# Altium schematic sheet 最小系统405RGT6.SchDoc
size A3
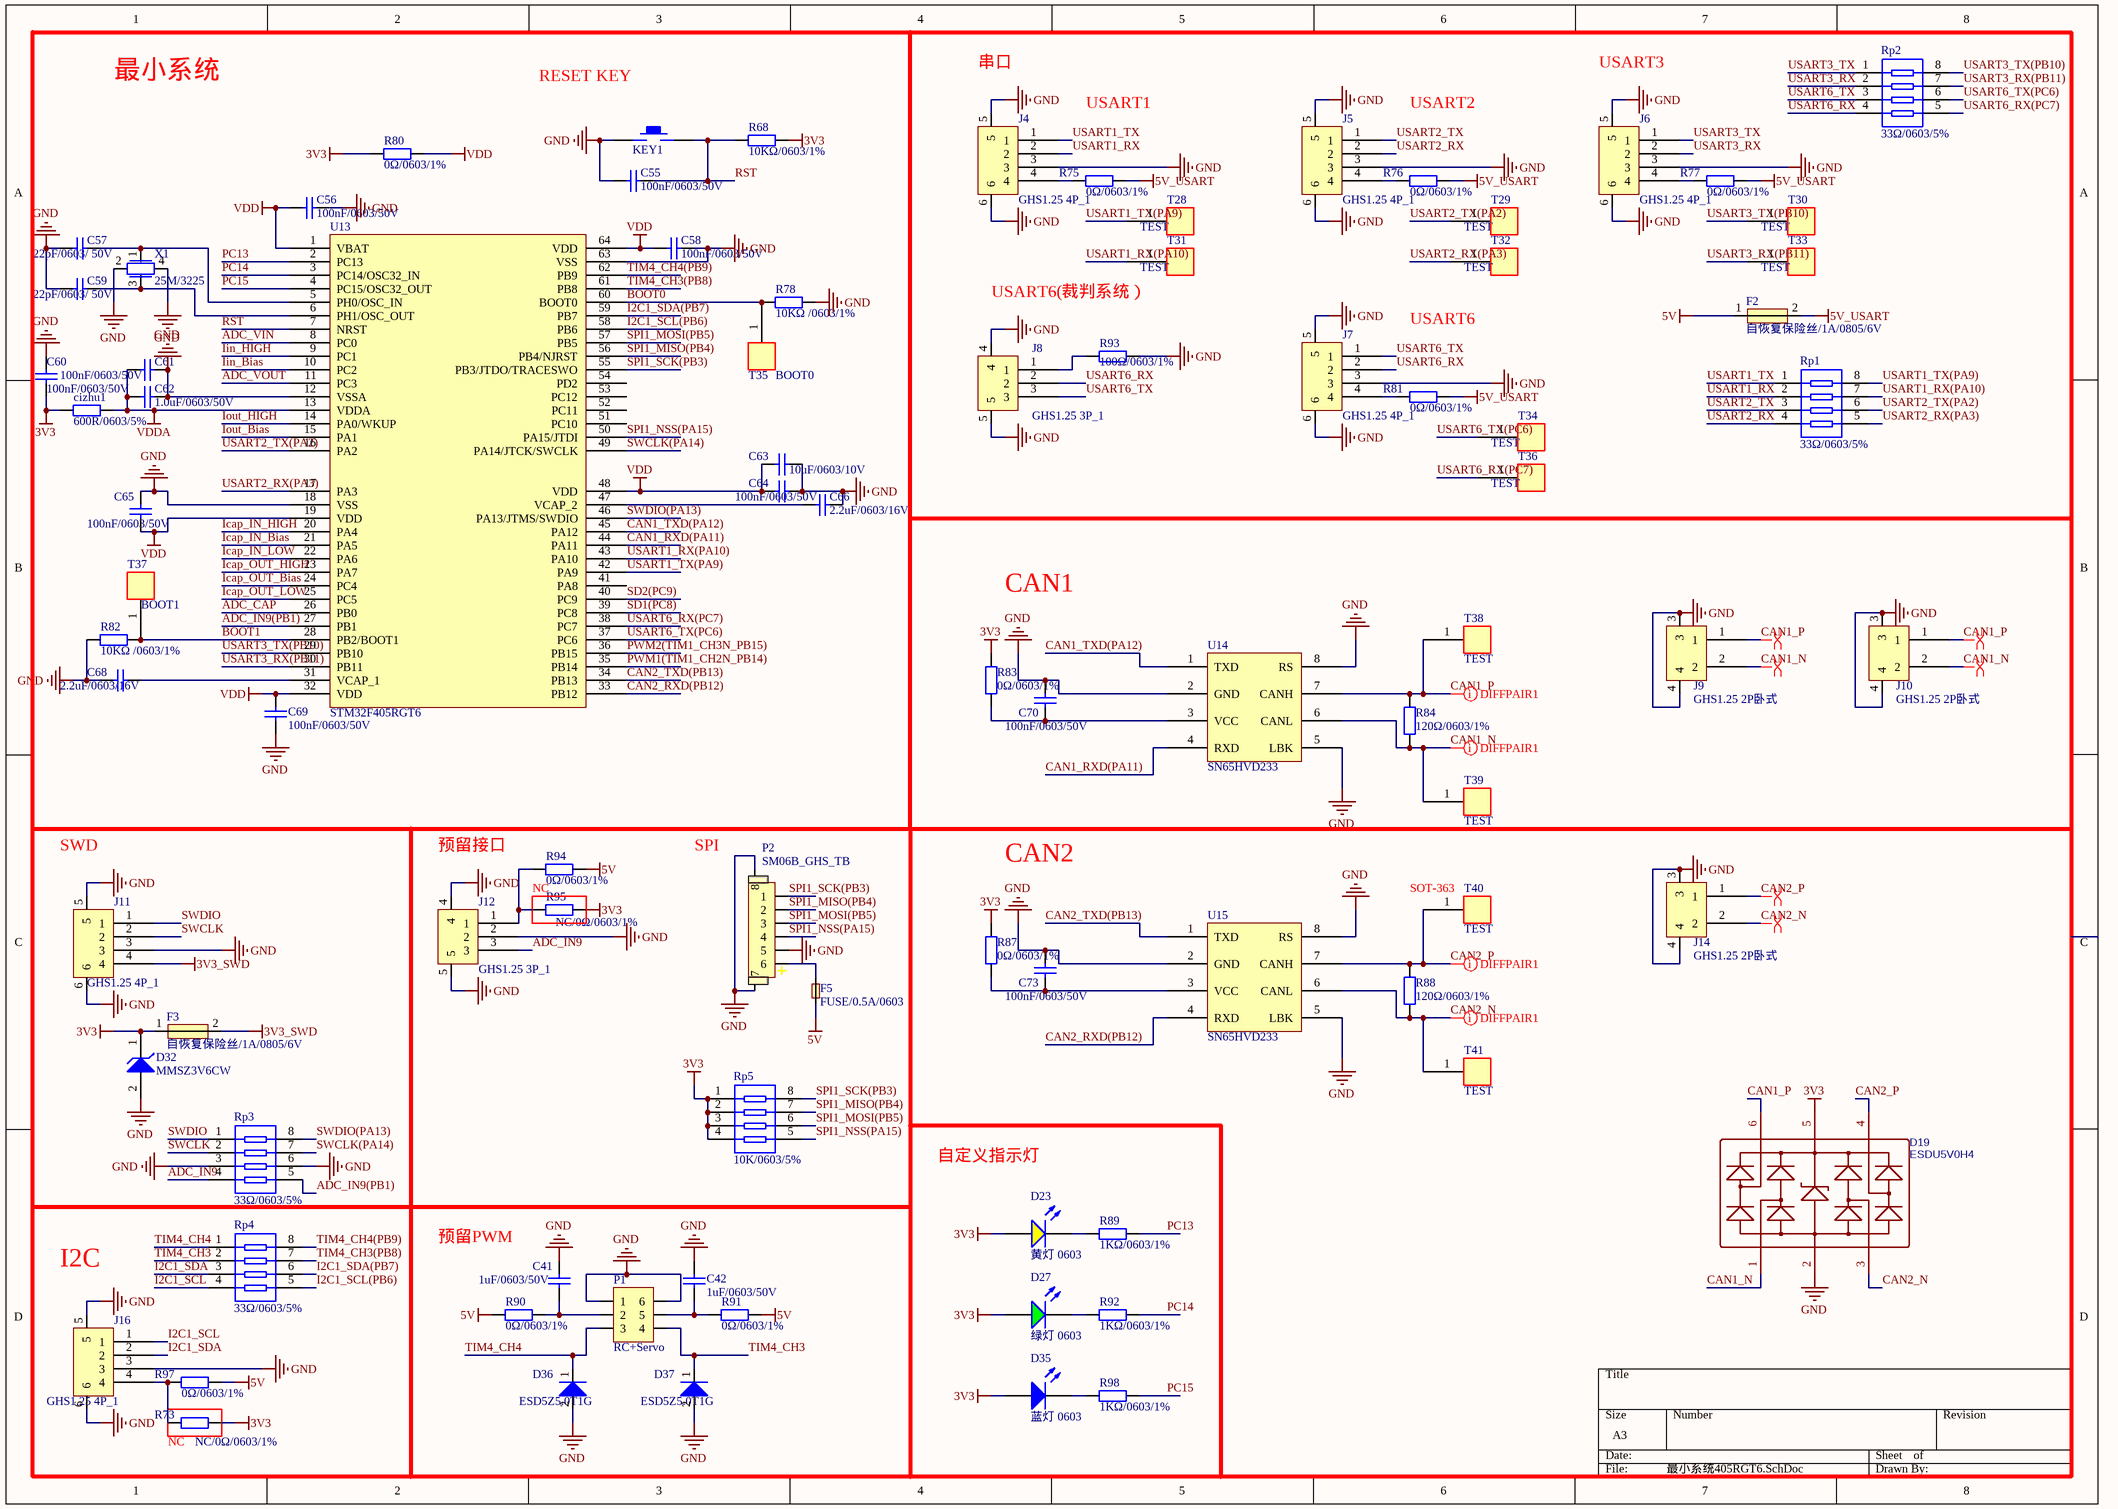
[diagram p0: 最小系统405RGT6.SchDoc]

## Parts
C41  1uF/0603/50V  [0603_C]
C42  1uF/0603/50V  [0603_C]
C55  100nF/0603/50V  [0603_C]
C56  100nF/0603/50V  [0603_C]
C57  22pF/0603/ 50V  [0603_C]
C58  100nF/0603/50V  [0603_C]
C59  22pF/0603/ 50V  [0603_C]
C60  100nF/0603/50V  [0603_C]
C61  100nF/0603/50V  [0603_C]
C62  1.0uF/0603/50V  [0603_C]
C63  10uF/0603/10V  [0603_C]
C64  100nF/0603/50V  [0603_C]
C65  100nF/0603/50V  [0603_C]
C66  2.2uF/0603/16V  [0603_C]
C68  2.2uF/0603/16V  [0603_C]
C69  100nF/0603/50V  [0603_C]
C70  100nF/0603/50V  [0603_C]
C73  100nF/0603/50V  [0603_C]
cizhu1  600R/0603/5%  [0603_R]
D19  ESDU5V0H4  [SOT-23-6_L2.9-W1.6-P0.95-LS2.8-BR]
D23  黄灯 0603  [0603_LED_S1]
D27  绿灯 0603  [0603_LED_S1]
D32  MMSZ3V6CW  [SOD-123]
D35  蓝灯 0603  [0603_LED_S1]
D36  ESD5Z5.0T1G  [SOD-523]
D37  ESD5Z5.0T1G  [SOD-523]
F2  自恢复保险丝/1A/0805/6V  [0805_R]
F3  自恢复保险丝/1A/0805/6V  [0805_R]
F5  FUSE/0.5A/0603  [0.5A/0603]
J4  GHS1.25 4P_1  [SM04B-GHS卧式]
J5  GHS1.25 4P_1  [SM04B-GHS卧式]
J6  GHS1.25 4P_1  [SM04B-GHS卧式]
J7  GHS1.25 4P_1  [SM04B-GHS卧式]
J8  GHS1.25 3P_1  [SM03B_GHS卧式]
J9  GHS1.25 2P卧式  [SM02B-GHS卧式]
J10  GHS1.25 2P卧式  [SM02B-GHS卧式]
J11  GHS1.25 4P_1  [SM04B-GHS卧式]
J12  GHS1.25 3P_1  [SM03B_GHS卧式]
J14  GHS1.25 2P卧式  [SM02B-GHS卧式]
J16  GHS1.25 4P_1  [SM04B-GHS卧式]
KEY1  KEY  [SW-SMD1]  (value not drawn)
P1  RC+Servo  [RC+Servo]
P2  SM06B_GHS_TB  [SM06B-GHS-TB]
R68  10KΩ/0603/1%  [0603_R]
R73  NC/0Ω/0603/1%  [0603_R]
R75  0Ω/0603/1%  [0603_R]
R76  0Ω/0603/1%  [0603_R]
R77  0Ω/0603/1%  [0603_R]
R78  10KΩ /0603/1%  [0603_R]
R80  0Ω/0603/1%  [0603_R]
R81  0Ω/0603/1%  [0603_R]
R82  10KΩ /0603/1%  [0603_R]
R83  0Ω/0603/1%  [0603_R]
R84  120Ω/0603/1%  [0603_R]
R87  0Ω/0603/1%  [0603_R]
R88  120Ω/0603/1%  [0603_R]
R89  1KΩ/0603/1%  [0603_R]
R90  0Ω/0603/1%  [0603_R]
R91  0Ω/0603/1%  [0603_R]
R92  1KΩ/0603/1%  [0603_R]
R93  100Ω/0603/1%  [0603_R]
R94  0Ω/0603/1%  [0603_R]
R95  NC/0Ω/0603/1%  [0603_R]
R97  0Ω/0603/1%  [0603_R]
R98  1KΩ/0603/1%  [0603_R]
Rp1  33Ω/0603/5%  [0603_Rx4]
Rp2  33Ω/0603/5%  [0603_Rx4]
Rp3  33Ω/0603/5%  [0603_Rx4]
Rp4  33Ω/0603/5%  [0603_Rx4]
Rp5  10K/0603/5%  [0603_Rx4]
T28  TEST  [测试点]
T29  TEST  [测试点]
T30  TEST  [测试点]
T31  TEST  [测试点]
T32  TEST  [测试点]
T33  TEST  [测试点]
T34  TEST  [测试点]
T35  BOOT0  [测试点]
T36  TEST  [测试点]
T37  BOOT1  [测试点]
T38  TEST  [测试点]
T39  TEST  [测试点]
T40  TEST  [测试点]
T41  TEST  [测试点]
U13  STM32F405RGT6  [LQFP64_M]
U14  SN65HVD233  [SOIC-8_150mil]
U15  SN65HVD233  [SOIC-8_150mil]
X1  25M/3225  [SMD-3225_4P]

## Nets
3V3: C60.2 cizhu1.1 D19.5(VCC) D23.A D27.A D32.1(K) D35.A F3.1 R68.2 R73.2 R80.1 R83.2 R87.2 R95.1 Rp5.1 Rp5.2 Rp5.3 Rp5.4
3V3_SWD: F3.2 J11.4
5V: F2.1 F5.1 R90.2 R91.1 R94.1 R97.2
5V_USART: F2.2 R75.2 R76.2 R77.2 R81.2
GND: C41.2 C42.2 C55.2 C56.1 C57.1 C58.1 C59.1 C60.1 C61.1 C62.1 C63.2 C64.2 C65.1 C66.2 C68.1 C69.2 C70.2 C73.2 D19.2(GND) D32.2(A) D36.2(A) D37.2(A) J4.3 J4.5 J4.6 J5.3 J5.5 J5.6 J6.3 J6.5 J6.6 J7.3 J7.5 J7.6 J8.4 J8.5 J9.3 J9.4 J10.3 J10.4 J11.3 J11.5 J11.6 J12.2 J12.4 J12.5 J14.3 J14.4 J16.3 J16.5 J16.6 KEY1.1 P1.1 P1.6 P2.5 P2.7 P2.8 R78.2 R82.1 R93.2 Rp3.3 Rp3.6 U13.12(VSSA) U13.18(VSS) U13.63(VSS) U14.2(GND) U14.5(LBK) U14.8(RS) U15.2(GND) U15.5(LBK) U15.8(RS) X1.2(GND) X1.4(GND)
VDD: C56.2 C58.2 C63.1 C64.1 C65.2 C69.1 R80.2 U13.1(VBAT) U13.19(VDD) U13.32(VDD) U13.48(VDD) U13.64(VDD)
VDDA: C61.2 C62.2 cizhu1.2 U13.13(VDDA)
ADC_CAP: U13.26(PB0)
ADC_IN9: J12.3 Rp3.4
ADC_IN9(PB1): Rp3.5 U13.27(PB1)
ADC_VIN: U13.8(PC0)
ADC_VOUT: U13.11(PC3)
BOOT0: R78.1 T35.1(VIN) U13.60(BOOT0)
BOOT1: R82.2 T37.1(VIN) U13.28(PB2/BOOT1)
CAN1_N: D19.1(IO1) J9.2 J10.2 R84.1 T39.1(VIN) U14.6(CANL)
CAN1_P: D19.6(IO2) J9.1 J10.1 R84.2 T38.1(VIN) U14.7(CANH)
CAN1_RXD(PA11): U13.44(PA11) U14.4(RXD)
CAN1_TXD(PA12): U13.45(PA12) U14.1(TXD)
CAN2_N: D19.3(IO3) J14.2 R88.1 T41.1(VIN) U15.6(CANL)
CAN2_P: D19.4(IO4) J14.1 R88.2 T40.1(VIN) U15.7(CANH)
CAN2_RXD(PB12): U13.33(PB12) U15.4(RXD)
CAN2_TXD(PB13): U13.34(PB13) U15.1(TXD)
I2C1_SCL: J16.1 Rp4.4
I2C1_SCL(PB6): Rp4.5 U13.58(PB6)
I2C1_SDA: J16.2 Rp4.3
I2C1_SDA(PB7): Rp4.6 U13.59(PB7)
Icap_IN_Bias: U13.21(PA5)
Icap_IN_HIGH: U13.20(PA4)
Icap_IN_LOW: U13.22(PA6)
Icap_OUT_Bias: U13.24(PC4)
Icap_OUT_HIGH: U13.23(PA7)
Icap_OUT_LOW: U13.25(PC5)
Iin_Bias: U13.10(PC2)
Iin_HIGH: U13.9(PC1)
Iout_Bias: U13.15(PA1)
Iout_HIGH: U13.14(PA0/WKUP)
PC13: R89.2 U13.2(PC13)
PC14: R92.2 U13.3(PC14/OSC32_IN)
PC15: R98.2 U13.4(PC15/OSC32_OUT)
PWM1(TIM1_CH2N_PB14): U13.35(PB14)
PWM2(TIM1_CH3N_PB15): U13.36(PB15)
RST: C55.1 KEY1.2 R68.1 U13.7(NRST)
SD1(PC8): U13.39(PC8)
SD2(PC9): U13.40(PC9)
SPI1_MISO(PB4): P2.2 Rp5.7 U13.56(PB4/NJRST)
SPI1_MOSI(PB5): P2.3 Rp5.6 U13.57(PB5)
SPI1_NSS(PA15): P2.4 Rp5.5 U13.50(PA15/JTDI)
SPI1_SCK(PB3): P2.1 Rp5.8 U13.55(PB3/JTDO/TRACESWO)
SWCLK: J11.2 Rp3.2
SWCLK(PA14): Rp3.7 U13.49(PA14/JTCK/SWCLK)
SWDIO: J11.1 Rp3.1
SWDIO(PA13): Rp3.8 U13.46(PA13/JTMS/SWDIO)
TIM4_CH3: D37.1(K) P1.4 Rp4.2
TIM4_CH3(PB8): Rp4.7 U13.61(PB8)
TIM4_CH4: D36.1(K) P1.3 Rp4.1
TIM4_CH4(PB9): Rp4.8 U13.62(PB9)
USART1_RX: J4.2 Rp1.2
USART1_RX(PA10): Rp1.7 T31.1(VIN) U13.43(PA10)
USART1_TX: J4.1 Rp1.1
USART1_TX(PA9): Rp1.8 T28.1(VIN) U13.42(PA9)
USART2_RX: J5.2 Rp1.4
USART2_RX(PA3): Rp1.5 T32.1(VIN) U13.17(PA3)
USART2_TX: J5.1 Rp1.3
USART2_TX(PA2): Rp1.6 T29.1(VIN) U13.16(PA2)
USART3_RX: J6.2 Rp2.2
USART3_RX(PB11): Rp2.7 T33.1(VIN) U13.30(PB11)
USART3_TX: J6.1 Rp2.1
USART3_TX(PB10): Rp2.8 T30.1(VIN) U13.29(PB10)
USART6_RX: J7.2 J8.2 Rp2.4
USART6_RX(PC7): Rp2.5 T36.1(VIN) U13.38(PC7)
USART6_TX: J7.1 J8.3 Rp2.3
USART6_TX(PC6): Rp2.6 T34.1(VIN) U13.37(PC6)
NetC41_1: C41.1 P1.2 R90.1
NetC42_1: C42.1 P1.5 R91.2
NetC57_2: C57.2 U13.5(PH0/OSC_IN) X1.1(OUT)
NetC59_2: C59.2 U13.6(PH1/OSC_OUT) X1.3(OUT)
NetC66_1: C66.1 U13.47(VCAP_2)
NetC68_2: C68.2 U13.31(VCAP_1)
NetC70_1: C70.1 R83.1 U14.3(VCC)
NetC73_1: C73.1 R87.1 U15.3(VCC)
NetD23_K: D23.K R89.1
NetD27_K: D27.K R92.1
NetD35_K: D35.K R98.1
NetF5_2: F5.2 P2.6
NetJ4_4: J4.4 R75.1
NetJ5_4: J5.4 R76.1
NetJ6_4: J6.4 R77.1
NetJ7_4: J7.4 R81.1
NetJ8_1: J8.1 R93.1
NetJ12_1: J12.1 R94.2 R95.2
NetJ16_4: J16.4 R73.1 R97.1

Not connected (* = marked no-connect by the designer): U13 41(PA8) 51(PC10) 52(PC11) 53(PC12) 54(PD2)

## Layout directives
differential pair: CAN1_N, CAN1_P, CAN2_N, CAN2_P

## Notes on the sheet
- 最小系统
- RESET KEY
- 串口
- USART1
- USART2
- USART3
- USART6(裁判系统）
- USART6
- CAN1
- SWD
- 预留接口
- (near P2) SPI
- NC
- CAN2
- (near T40) SOT-363
- 自定义指示灯
- 预留PWM
- I2C
- (near R73) NC

## Library data of the parts
C41 C42 = 0603 1uF (105) 10% 50V: 贴片电容; ComponentLink1Description: 供应商链接; ComponentLink1URL: http://www.szlcsc.com/product/details_16531.html; Package: 0603; Supplier: LC; SuppliersPartNumber: C15849
C55 C56 C58 C60-C62 C64 C65 C69 C70 C73 = 0603 100nF (104) 10% 50V: 贴片电容; ComponentLink1Description: 供应商链接; ComponentLink1URL: http://www.szlcsc.com/product/details_15331.html; Package: 0603; Supplier: LC; SuppliersPartNumber: C14663
C57 C59 = 0603 22pF (220) 5% 50V: 贴片电容; ComponentLink1Description: 供应商链接; ComponentLink1URL: http://www.szlcsc.com/product/details_2005.html; Package: 0603; Supplier: LC; SuppliersPartNumber: C1653
C63 = 0603 10uF (106) 10% 10V: 贴片电容; ComponentLink1Description: 供应商链接; ComponentLink1URL: http://www.szlcsc.com/product/details_20411.html; Package: 0603; Supplier: LC; SuppliersPartNumber: C19702
C66 C68 = 0603 2.2uF (225) 10% 16V: 贴片电容; ComponentLink1Description: 供应商链接; ComponentLink1URL: http://www.szlcsc.com/product/details_24366.html; Package: 0603; Supplier: LC; SuppliersPartNumber: C23630
cizhu1 R84 R88 R93 = 0603 100Ω (1000) 1%: 贴片电阻; ComponentLink1Description: 供应商链接; ComponentLink1URL: http://www.szlcsc.com/product/details_23502.html; Package: 0603; Supplier: LC; SuppliersPartNumber: C22775
D19 = ESDU5V0H4: ESD; BOM_Manufacturer: CJ; BOM_Supplier: LCSC; BOM_Manufacturer Part: ESDU5V0H4; BOM_Supplier Part: C84837; BOM_JLCPCB Part Class: Extended Part; spicePre: D; spiceSymbolName: ESDU5V0H4
D23 = 0603 黄灯: 发光二极管; ComponentLink1Description: 供应商链接; ComponentLink1URL: http://www.szlcsc.com/product/details_73147.html; Package: 0603; Supplier: LC; SuppliersPartNumber: C72038
D27 = 0603 绿灯: 发光二极管; ComponentLink1Description: 供应商链接; ComponentLink1URL: http://www.szlcsc.com/product/details_73152.html; Package: 0603; Supplier: LC; SuppliersPartNumber: C72043
D32 = LL-34 ZMM3V3: 稳压二极管; ComponentLink1Description: 供应商链接; ComponentLink1URL: http://www.szlcsc.com/product/details_8535.html; Package: LL-34; Supplier: LC; SuppliersPartNumber: C8056
D35 = 0603 蓝灯: 发光二极管; ComponentLink1Description: 供应商链接; ComponentLink1URL: http://www.szlcsc.com/product/details_73150.html; Package: 0603; Supplier: LC; SuppliersPartNumber: C72041
D36 D37 = TVS_SOD-523: 单向TVS
F2 F3 = FUSE/0805
F5 = FUSE/0.5A/0603: FUSE; SuppliersPartNumber: C136319
J4-J7 J11 J16 = GHS1.25 4P_1: 卧式短边
J8 J12 = GHS1.25 3P_1: 卧式
J9 J10 J14 = GHS1.25 2P_1: 卧式
KEY1 = KEY: 开关
P1 = DBUS+Servo
R68 R78 R82 = 0603 10KΩ (1002) 1%: 贴片电阻; ComponentLink1Description: 供应商链接; ComponentLink1URL: http://www.szlcsc.com/product/details_26547.html; Package: 0603; Supplier: LC; SuppliersPartNumber: C25804
R73 R75-R77 R80 R81 R83 R87 R90 R91 R94 R95 R97 = 0603 0Ω (0R0) 1%: 贴片电阻; ComponentLink1Description: 供应商链接; ComponentLink1URL: http://www.szlcsc.com/product/details_21903.html; Package: 0603; Supplier: LC; SuppliersPartNumber: C21189
R89 R92 R98 = 0603 1KΩ (1001) 1%: 贴片电阻; ComponentLink1Description: 供应商链接; ComponentLink1URL: http://www.szlcsc.com/product/details_21904.html; Package: 0603; Supplier: LC; SuppliersPartNumber: C21190
Rp1-Rp5 = 0603*4  10KΩ (103) 5%: 贴片排阻; ComponentLink1Description: 供应商链接; ComponentLink1URL: http://www.szlcsc.com/product/details_30472.html; Package: 0603*4; Supplier: LC; SuppliersPartNumber: C29718
T28-T41 = 测试点
X1 = XTAL_4